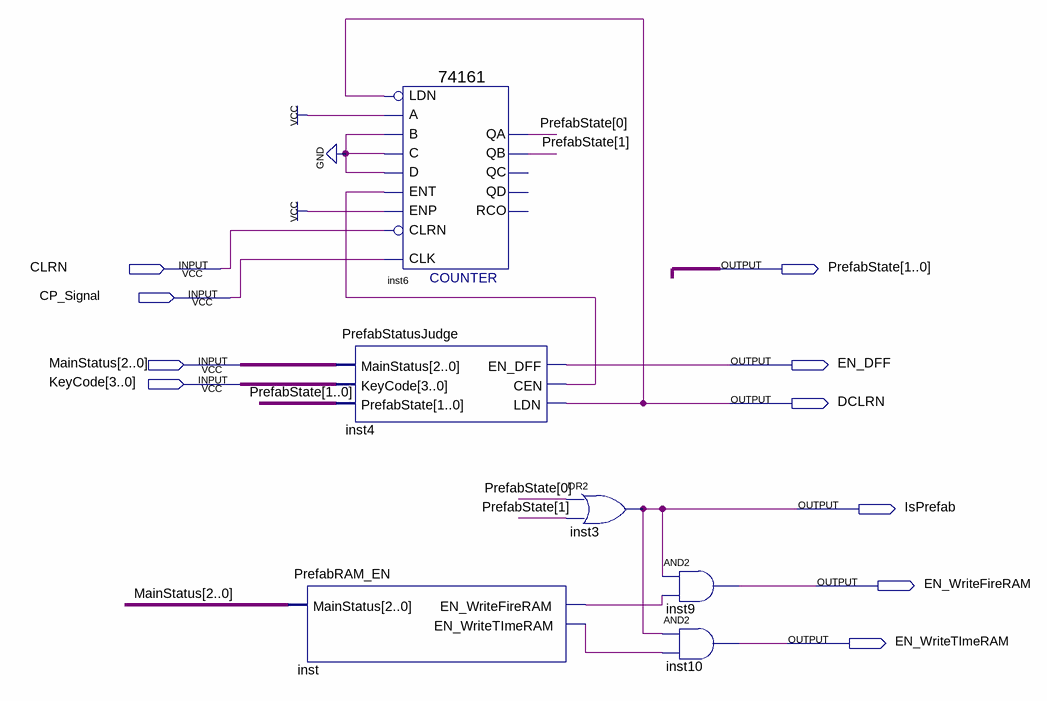
[diagram p0: schematic sheet]
// Quartus schematic PrefabStatusControl.bdf as structural Verilog: 6 symbols, 10 pins
module PrefabStatusControl (
  input  CLRN,
  input  CP_Signal,
  input  [2:0] MainStatus,
  input  [3:0] KeyCode,
  output [1:0] PrefabState,
  output EN_DFF,
  output DCLRN,
  output IsPrefab,
  output EN_WriteFireRAM,
  output EN_WriteTImeRAM
);

  wire inst4_cen, inst_en_writefireram, inst_en_writetimeram;

  PrefabRAM_EN inst (
    .MainStatus(MainStatus), .EN_WriteFireRAM(inst_en_writefireram), .EN_WriteTImeRAM(inst_en_writetimeram));
  \74161  inst6 (
    .CLRN(CLRN), .CLK(CP_Signal), .ENP(1'b1), .LDN(DCLRN), .A(1'b1), .D(1'b0), .ENT(inst4_cen), .B(1'b0),
    .C(1'b0), .QB(PrefabState[1]), .QA(PrefabState[0]));  // open: QD, QC, RCO
  PrefabStatusJudge inst4 (
    .MainStatus(MainStatus), .KeyCode(KeyCode), .PrefabState(PrefabState), .EN_DFF(EN_DFF), .CEN(inst4_cen),
    .LDN(DCLRN));
  or inst3 (IsPrefab, PrefabState[0], PrefabState[1]);
  and inst9 (EN_WriteFireRAM, IsPrefab, inst_en_writefireram);
  and inst10 (EN_WriteTImeRAM, IsPrefab, inst_en_writetimeram);
endmodule
